# Altium schematic sheet Power.SchDoc
size A4; SheetNumber: 6; SheetTotal: 10
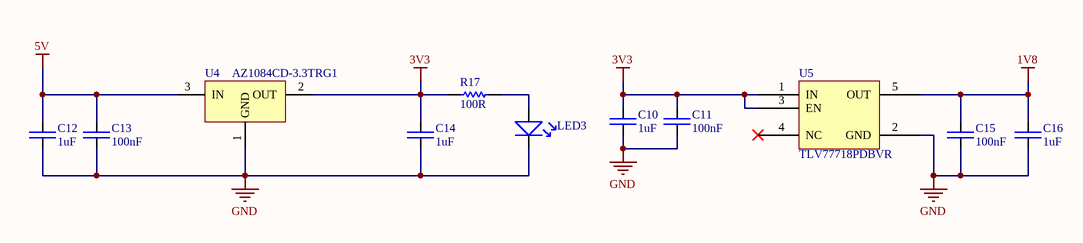
[diagram p0: Power.SchDoc]

## Parts
C10  1uF  [CAP-0805]
C11  100nF  [CAP-0603]
C12  1uF  [CAP-0805]
C13  100nF  [CAP-0603]
C14  1uF  [CAP-0805]
C15  100nF  [CAP-0603]
C16  1uF  [CAP-0805]
LED3  0603 LED  [0603 LED]  (value not drawn)
R17  100R  [RES-0603]
U4  AZ1084CD-3.3TRG1  [AZ1084CD-3.3TRG1]
U5  TLV77718PDBVR  [TLV77718PDBVR]

## Nets
1V8: C15.2 C16.2 U5.5(OUT)
3V3: C10.2 C11.2 C14.2 R17.1 U4.2(OUT) U5.1(IN) U5.3(EN)
5V: C12.2 C13.2 U4.3(IN)
GND: C10.1 C11.1 C12.1 C13.1 C14.1 C15.1 C16.1 LED3.2 U4.1(GND) U5.2(GND)
NetLED3_1: LED3.1 R17.2

Not connected (* = marked no-connect by the designer): U5 4(NC)*

## Library data of the parts
C10 C12 C14 C16 = CAP-0805: Capacitor chip unpolarized. 0805
C11 C13 C15 = CAP-0603: Capacitor chip unpolarized. 0603
R17 = RES-0603: Resistor chip. 0603
U4 = AZ1084CD-3.3TRG1: 3V3 LDO 1A 1.5V Dropout
U5 = TLV77718PDBVR: LDO 1.8V 1A